# Altium schematic sheet EnviroSense.SchDoc: EnviroSense Weather Monitor
size A4; SheetNumber: 1; SheetTotal: 7
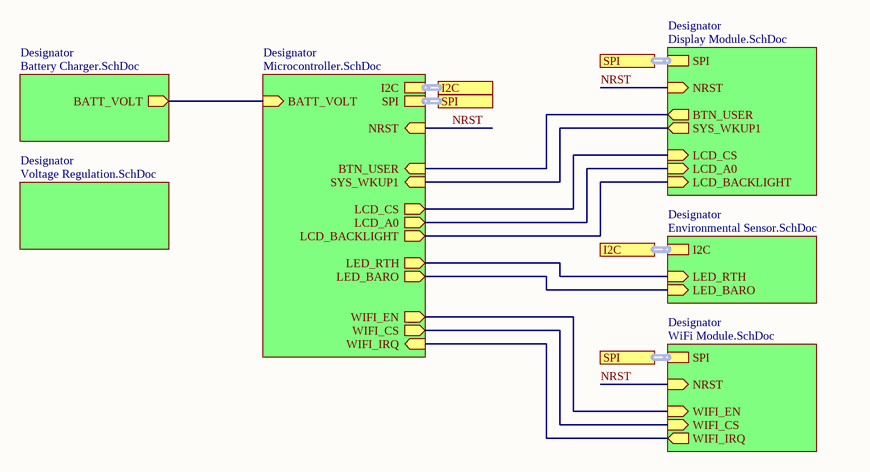
[diagram p0: EnviroSense.SchDoc]

## Sub-sheets
Designator = Microcontroller.SchDoc: LCD_CS (out), BATT_VOLT (in), NRST (in), LCD_A0 (out), WIFI_EN (out), LED_BARO (out), LCD_BACKLIGHT (out), WIFI_IRQ (in), SYS_WKUP1 (in), I2C (harness I2C), BTN_USER (in), WIFI_CS (out), SPI (harness SPI), LED_RTH (out)
Designator = Battery Charger.SchDoc: BATT_VOLT (out)
Designator = Voltage Regulation.SchDoc: no entries
Designator = WiFi Module.SchDoc: WIFI_EN (in), WIFI_IRQ (out), NRST (in), SPI (harness SPI), WIFI_CS (in)
Designator = Environmental Sensor.SchDoc: LED_BARO (in), I2C (harness I2C), LED_RTH (in)
Designator = Display Module.SchDoc: LCD_A0 (in), SPI (harness SPI), NRST (in), BTN_USER (out), SYS_WKUP1 (out), LCD_CS (in), LCD_BACKLIGHT (in)

## Ports
I2C (harness I2C), SPI (harness SPI)

## Nets
NRST: sheet Designator/NRST, sheet Designator/NRST, sheet Designator/NRST
(unnamed): sheet Designator/LCD_CS, sheet Designator/LCD_CS
(unnamed): sheet Designator/BATT_VOLT, sheet Designator/BATT_VOLT
(unnamed): sheet Designator/LCD_A0, sheet Designator/LCD_A0
(unnamed): sheet Designator/WIFI_EN, sheet Designator/WIFI_EN
(unnamed): sheet Designator/LED_BARO, sheet Designator/LED_BARO
(unnamed): sheet Designator/LCD_BACKLIGHT, sheet Designator/LCD_BACKLIGHT
(unnamed): sheet Designator/WIFI_IRQ, sheet Designator/WIFI_IRQ
(unnamed): sheet Designator/SYS_WKUP1, sheet Designator/SYS_WKUP1
(unnamed): sheet Designator/BTN_USER, sheet Designator/BTN_USER
(unnamed): sheet Designator/WIFI_CS, sheet Designator/WIFI_CS
(unnamed): sheet Designator/LED_RTH, sheet Designator/LED_RTH

## Buses and harness runs
harness port I2C = sheet Designator/I2C
harness port SPI = sheet Designator/SPI

## Notes on the sheet
- Title
- Size:
- Date:
- A4
- Number:
- Time:
- Revision:
- Sheet
- of
- File: